# Altium schematic sheet Sheet1.SchDoc
size A4
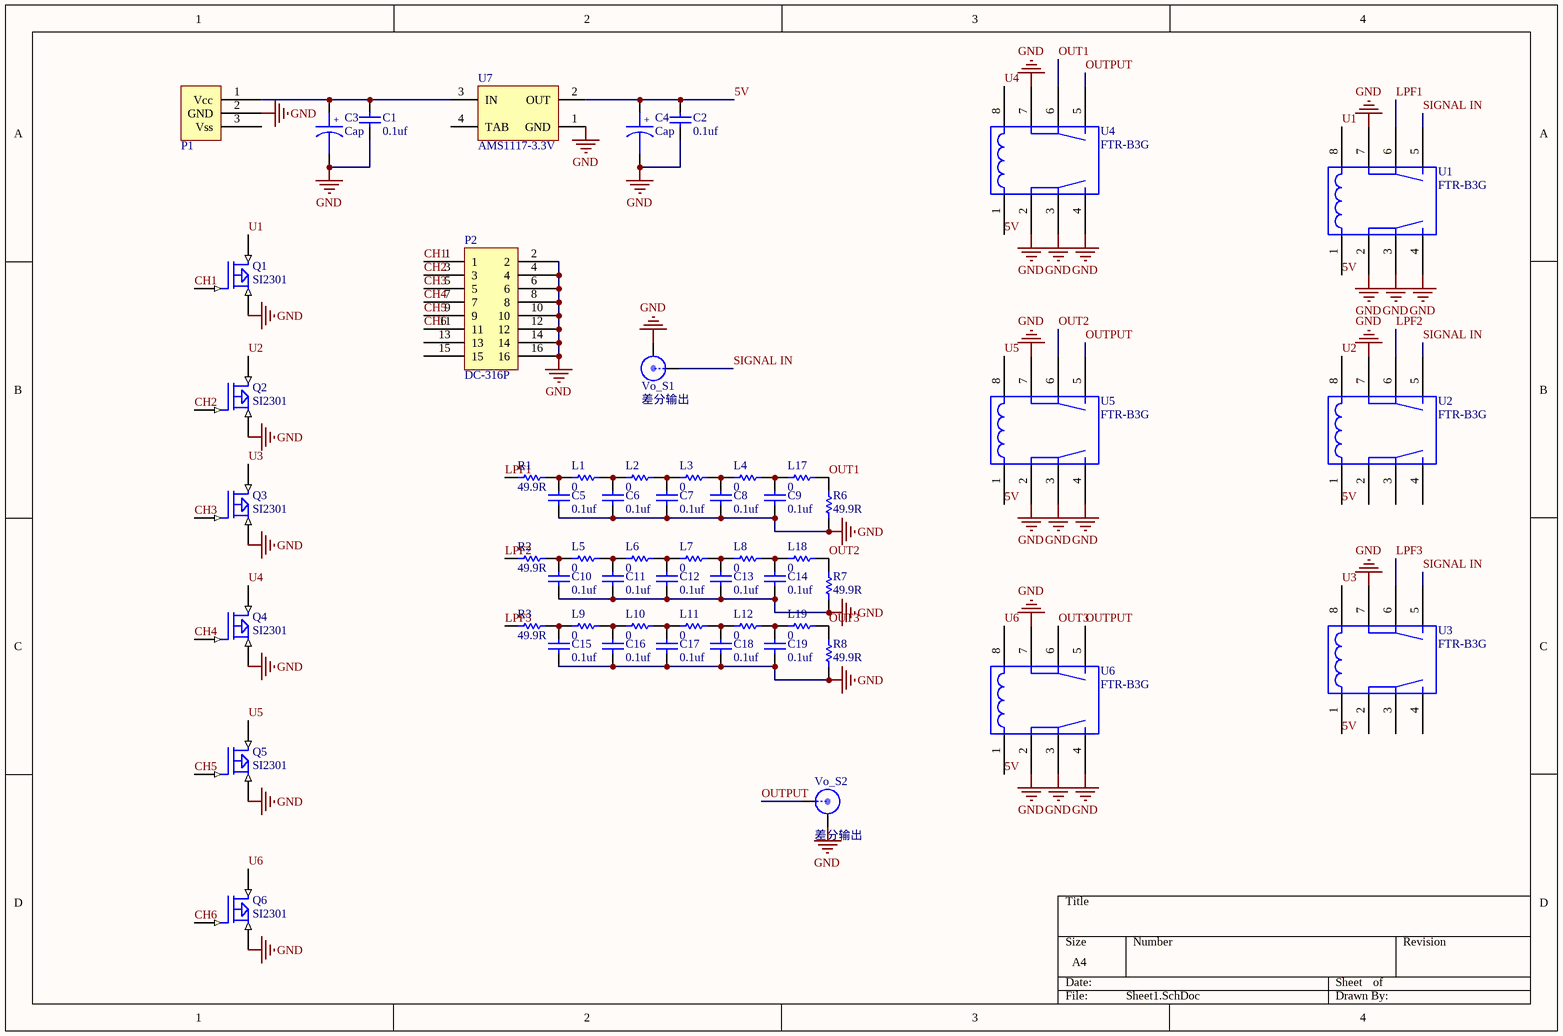
[diagram p0: Sheet1.SchDoc]

## Parts
C1  0.1uf  [0805]
C2  0.1uf  [0805]
C3  Cap  [3216C-TYPE_A]
C4  Cap  [3216C-TYPE_A]
C5  0.1uf  [0603C]
C6  0.1uf  [0603C]
C7  0.1uf  [0603C]
C8  0.1uf  [0603C]
C9  0.1uf  [0603C]
C10  0.1uf  [0603C]
C11  0.1uf  [0603C]
C12  0.1uf  [0603C]
C13  0.1uf  [0603C]
C14  0.1uf  [0603C]
C15  0.1uf  [0603C]
C16  0.1uf  [0603C]
C17  0.1uf  [0603C]
C18  0.1uf  [0603C]
C19  0.1uf  [0603C]
L1  0  [0603R]
L2  0  [0603R]
L3  0  [0603R]
L4  0  [0603R]
L5  0  [0603R]
L6  0  [0603R]
L7  0  [0603R]
L8  0  [0603R]
L9  0  [0603R]
L10  0  [0603R]
L11  0  [0603R]
L12  0  [0603R]
L17  0  [0603R]
L18  0  [0603R]
L19  0  [0603R]
P1  XH2.54-3p  [XH2.54-3p]  (value not drawn)
P2  DC-316P  [DC3-14P]
Q1  SI2301  [SOT-23]
Q2  SI2301  [SOT-23]
Q3  SI2301  [SOT-23]
Q4  SI2301  [SOT-23]
Q5  SI2301  [SOT-23]
Q6  SI2301  [SOT-23]
R1  49.9R  [0603R]
R2  49.9R  [0603R]
R3  49.9R  [0603R]
R6  49.9R  [0603R]
R7  49.9R  [0603R]
R8  49.9R  [0603R]
U1  FTR-B3G  [FTR-B3G]
U2  FTR-B3G  [FTR-B3G]
U3  FTR-B3G  [FTR-B3G]
U4  FTR-B3G  [FTR-B3G]
U5  FTR-B3G  [FTR-B3G]
U6  FTR-B3G  [FTR-B3G]
U7  AMS1117-3.3V  [SOT-223]
Vo_S1  差分输出  [SMA-LYING]
Vo_S2  差分输出  [SMA-LYING]

## Nets
GND: C1.1 C2.1 C3.2 C4.2 C5.1 C6.1 C7.1 C8.1 C9.1 C10.1 C11.1 C12.1 C13.1 C14.1 C15.1 C16.1 C17.1 C18.1 C19.1 P1.2(GND) P2.2 P2.4 P2.6 P2.8 P2.10 P2.12 P2.14 P2.16 Q1.3(D) Q2.3(D) Q3.3(D) Q4.3(D) Q5.3(D) Q6.3(D) R6.1 R7.1 R8.1 U1.2 U1.3 U1.4 U1.7 U2.7 U3.7 U4.2 U4.3 U4.4 U4.7 U5.2 U5.3 U5.4 U5.7 U6.2 U6.3 U6.4 U6.7 U7.1(GND) Vo_S1.1 Vo_S2.1
5V: C2.2 C4.1 U1.1 U2.1 U3.1 U4.1 U5.1 U6.1 U7.2(OUT)
CH1: P2.1 Q1.1(G)
CH2: P2.3 Q2.1(G)
CH3: P2.5 Q3.1(G)
CH4: P2.7 Q4.1(G)
CH5: P2.9 Q5.1(G)
CH6: P2.11 Q6.1(G)
LPF1: R1.1 U1.6
LPF2: R2.1 U2.6
LPF3: R3.1 U3.6
OUT1: L17.2 R6.2 U4.6
OUT2: L18.2 R7.2 U5.6
OUT3: L19.2 R8.2 U6.6
OUTPUT: U4.5 U5.5 U6.5 Vo_S2.0
SIGNAL IN: U1.5 U2.5 U3.5 Vo_S1.0
U1: Q1.2(S) U1.8
U2: Q2.2(S) U2.8
U3: Q3.2(S) U3.8
U4: Q4.2(S) U4.8
U5: Q5.2(S) U5.8
U6: Q6.2(S) U6.8
NetC1_2: C1.2 C3.1 P1.1(Vcc) U7.3(IN)
NetC5_2: C5.2 L1.1 R1.2
NetC6_2: C6.2 L1.2 L2.1
NetC7_2: C7.2 L2.2 L3.1
NetC8_2: C8.2 L3.2 L4.1
NetC9_2: C9.2 L4.2 L17.1
NetC10_2: C10.2 L5.1 R2.2
NetC11_2: C11.2 L5.2 L6.1
NetC12_2: C12.2 L6.2 L7.1
NetC13_2: C13.2 L7.2 L8.1
NetC14_2: C14.2 L8.2 L18.1
NetC15_2: C15.2 L9.1 R3.2
NetC16_2: C16.2 L9.2 L10.1
NetC17_2: C17.2 L10.2 L11.1
NetC18_2: C18.2 L11.2 L12.1
NetC19_2: C19.2 L12.2 L19.1

Not connected (* = marked no-connect by the designer): P1 3(Vss); P2 13 15; U2 2 3 4; U3 2 3 4; U7 4(TAB)

## Notes on the sheet
- (in symbol Tantalium Cap) +

## Library data of the parts
C1 C2 C5-C19 = Cap
C3 C4 = Tantalium Cap
L1-L12 L17-L19 R1-R3 R6-R8 = Res
P2 = DC3-16P
Vo_S1 Vo_S2 = SMA